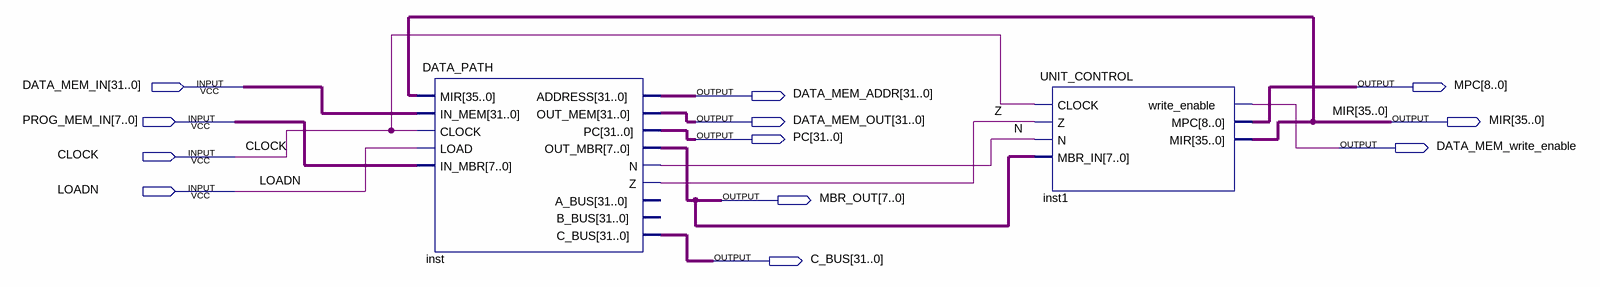
[diagram p0: schematic sheet]
// Quartus schematic CPU.bdf as structural Verilog: 2 symbols, 12 pins
module CPU (
  input  [31:0] DATA_MEM_IN,
  input  [7:0] PROG_MEM_IN,
  input  CLOCK,
  input  LOADN,
  output [8:0] MPC,
  output [31:0] DATA_MEM_ADDR,
  output [31:0] DATA_MEM_OUT,
  output [35:0] MIR,
  output [31:0] PC,
  output DATA_MEM_write_enable,
  output [7:0] MBR_OUT,
  output [31:0] C_BUS
);

  wire N, Z;

  DATA_PATH inst (
    .MIR(MIR), .IN_MEM(DATA_MEM_IN), .CLOCK(CLOCK), .LOAD(LOADN), .IN_MBR(PROG_MEM_IN),
    .ADDRESS(DATA_MEM_ADDR), .OUT_MEM(DATA_MEM_OUT), .PC(PC), .OUT_MBR(MBR_OUT), .N(N), .Z(Z), .C_BUS(C_BUS));  // open: A_BUS, B_BUS
  UNIT_CONTROL inst1 (
    .CLOCK(CLOCK), .Z(Z), .N(N), .MBR_IN(MBR_OUT), .write_enable(DATA_MEM_write_enable), .MPC(MPC), .MIR(MIR));
endmodule
